# Altium schematic sheet 0047_PCH VALIDATION.SchDoc
size A3
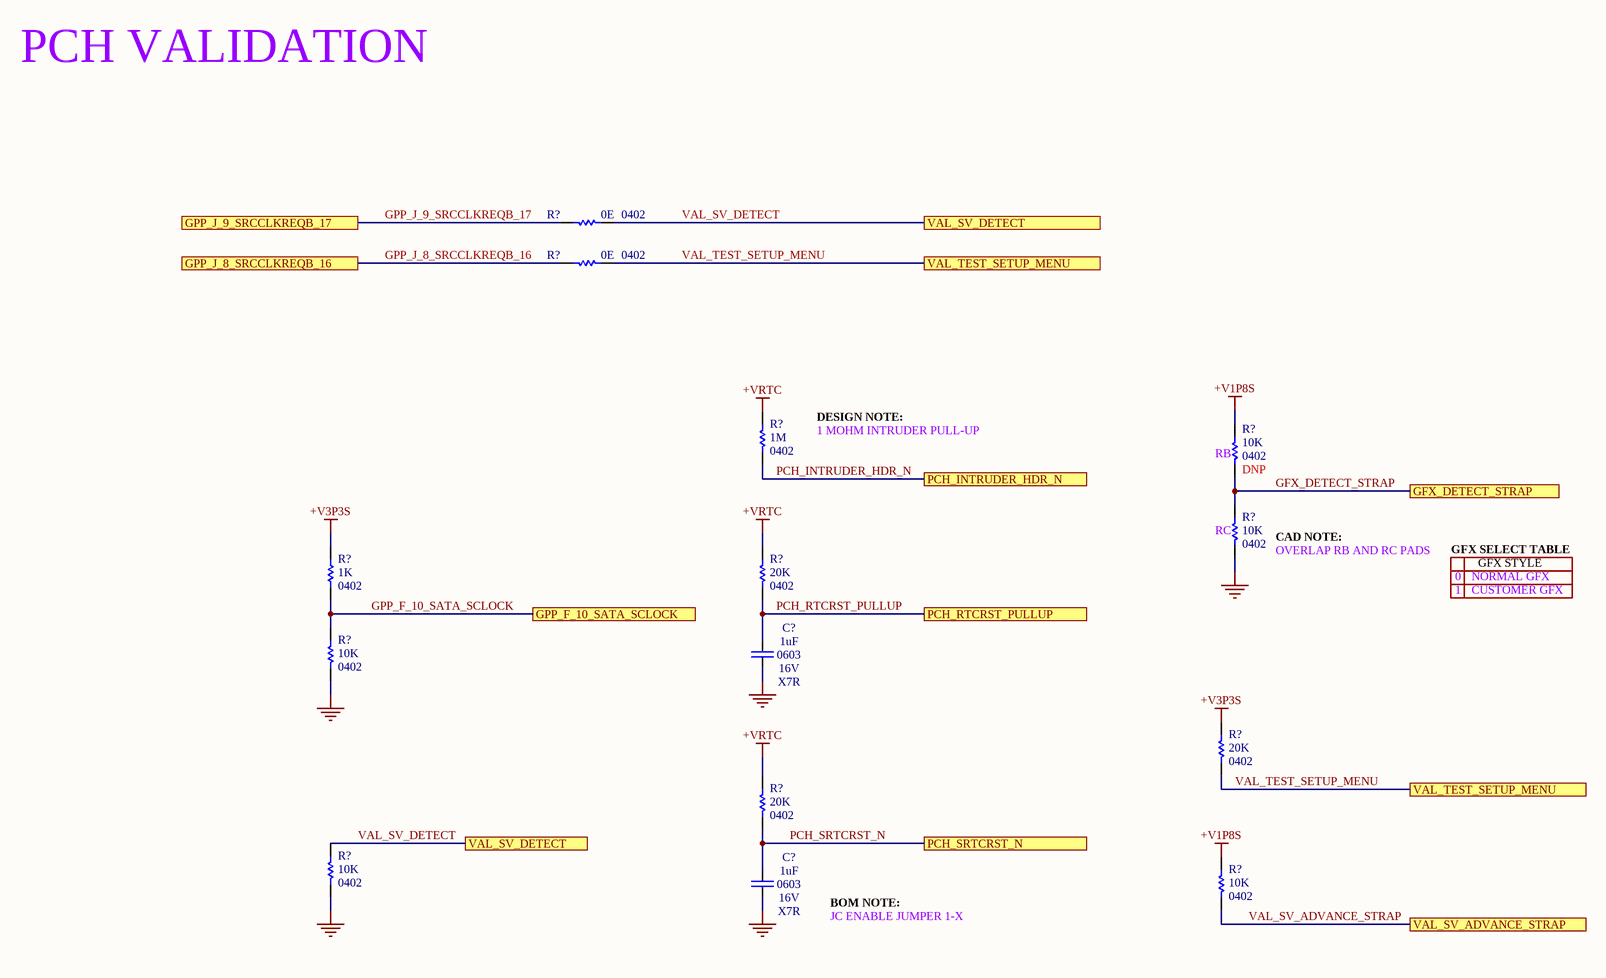
[diagram p0: 0047_PCH VALIDATION.SchDoc]

## Parts
(Parts that share a designator on the sheet are numbered #1, #2 ... from top to bottom, then left to right.)
C?#1  value 1uF  Case/Package: 0603  Voltage: 16V  Dielectric: X7R  [CAPC0603]
C?#2  value 1uF  Case/Package: 0603  Voltage: 16V  Dielectric: X7R  [CAPC0603]
R?#1  value 0E  Case/Package: 0402  [RESC0402]  (hidden comment: Res)
R?#2  value 0E  Case/Package: 0402  [RESC0402]  (hidden comment: Res)
R?#3  value 1M  Case/Package: 0402  [RESC0402]  (hidden comment: Res)
R?#4  value 10K  Case/Package: 0402  [RESC0402]  (hidden comment: Res)
R?#5  value 10K  Case/Package: 0402  [RESC0402]  (hidden comment: Res)
R?#6  value 1K  Case/Package: 0402  [RESC0402]  (hidden comment: Res)
R?#7  value 20K  Case/Package: 0402  [RESC0402]  (hidden comment: Res)
R?#8  value 10K  Case/Package: 0402  [RESC0402]  (hidden comment: Res)
R?#9  value 20K  Case/Package: 0402  [RESC0402]  (hidden comment: Res)
R?#10  value 20K  Case/Package: 0402  [RESC0402]  (hidden comment: Res)
R?#11  value 10K  Case/Package: 0402  [RESC0402]  (hidden comment: Res)
R?#12  value 10K  Case/Package: 0402  [RESC0402]  (hidden comment: Res)

## Ports
GFX_DETECT_STRAP, GPP_F_10_SATA_SCLOCK, GPP_J_8_SRCCLKREQB_16, GPP_J_9_SRCCLKREQB_17, PCH_INTRUDER_HDR_N, PCH_RTCRST_PULLUP, PCH_SRTCRST_N, VAL_SV_ADVANCE_STRAP, VAL_SV_DETECT, VAL_TEST_SETUP_MENU

## Nets
+V1P8S: R?#4.2 R?#12.2
+V3P3S: R?#6.2 R?#9.2
+VRTC: R?#3.2 R?#7.2 R?#10.2
GND: C?#1.1 C?#2.1 R?#5.1 R?#8.1 R?#11.1
GFX_DETECT_STRAP: R?#4.1 R?#5.2 ; port GFX_DETECT_STRAP
GPP_F_10_SATA_SCLOCK: R?#6.1 R?#8.2 ; port GPP_F_10_SATA_SCLOCK
GPP_J_8_SRCCLKREQB_16: R?#2.1 ; port GPP_J_8_SRCCLKREQB_16
GPP_J_9_SRCCLKREQB_17: R?#1.1 ; port GPP_J_9_SRCCLKREQB_17
PCH_INTRUDER_HDR_N: R?#3.1 ; port PCH_INTRUDER_HDR_N
PCH_RTCRST_PULLUP: C?#1.2 R?#7.1 ; port PCH_RTCRST_PULLUP
PCH_SRTCRST_N: C?#2.2 R?#10.1 ; port PCH_SRTCRST_N
VAL_SV_ADVANCE_STRAP: R?#12.1 ; port VAL_SV_ADVANCE_STRAP
VAL_SV_DETECT: R?#1.2 R?#11.2 ; port VAL_SV_DETECT
VAL_TEST_SETUP_MENU: R?#2.2 R?#9.1 ; port VAL_TEST_SETUP_MENU

## Notes on the sheet
- PCH VALIDATION
- DESIGN NOTE:
- 1 MOHM INTRUDER PULL-UP
- (near R?#4) RB
- (near R?#5) RC
- (near R?#5) CAD NOTE:
- (near R?#5) OVERLAP RB AND RC PADS
- GFX SELECT TABLE
- 0
- 1
- NORMAL GFX
- CUSTOMER GFX
- GFX STYLE
- BOM NOTE:
- JC ENABLE JUMPER 1-X

## Library data of the parts
C?#1 C?#2 = Cap: CAP CER 1uF 16V X7R 0603
R?#1 R?#2 = Res: Thick Film Resistor -  0ohm, 1%, 0402
R?#3 = Res: Thick Film Resistor -  1Mohm, 1%, 0402
R?#4 R?#5 R?#8 R?#11 R?#12 = Res: Thick Film Resistor -  10Kohm, 1%, 0402
  R?#4: DNP: DNP
R?#6 = Res: Thick Film Resistor -  1Kohm, 1%, 0402
R?#7 R?#9 R?#10 = Res: Thick Film Resistor -  20Kohm, 1%, 0402